# EAGLE design Adafruit Proto Under Plate PiCowBell (EAGLE 9.6.2)
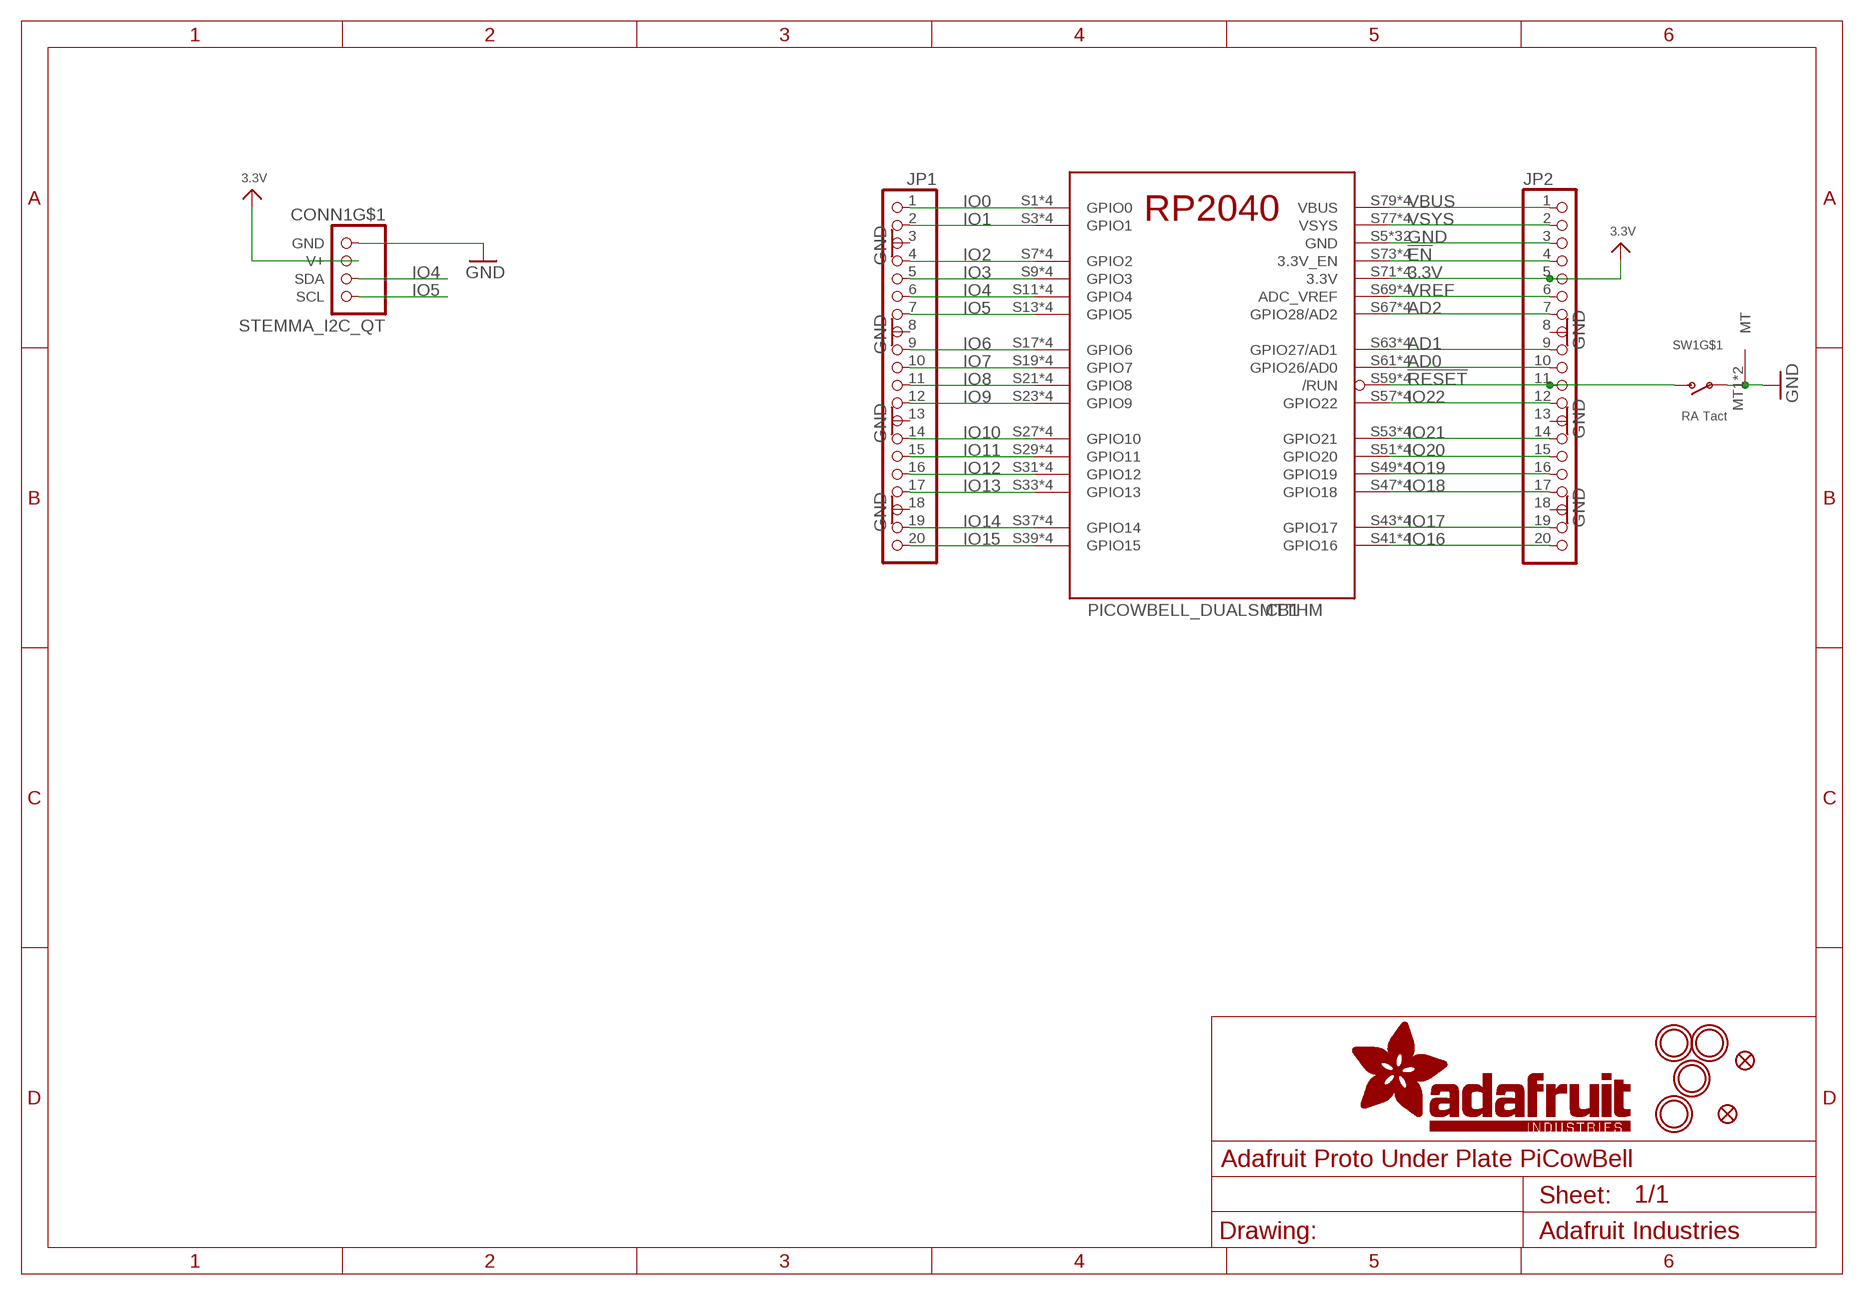
[diagram p0: schematic, sheet 1]

## Parts
CB1  PICOWBELL_DUALSMTTHM  [PICOWBELL_DUALSMTTHM]
CONN1  STEMMA_I2C_QT  [JST_SH4]
FID1  FIDUCIAL_1MM  [FIDUCIAL_1MM]
FID2  FIDUCIAL_1MM  [FIDUCIAL_1MM]
JP1  HEADER-1X20_70MIL  [1X20_ROUND_70MIL]
JP2  HEADER-1X20_70MIL  [1X20_ROUND_70MIL]
SW1  RA Tact  SWITCH_SPST_MNT_TACT_RA  [SPST_TACTILE_RA]
U$5  MOUNTINGHOLE2.5  [MOUNTINGHOLE_2.5_PLATED]
U$7  MOUNTINGHOLE2.5  [MOUNTINGHOLE_2.5_PLATED]
U$8  MOUNTINGHOLE2.5  [MOUNTINGHOLE_2.5_PLATED]
U$9  MOUNTINGHOLE2.5  [MOUNTINGHOLE_2.5_PLATED]

## Nets
3.3V: CB1.S71(3.3V) CB1.S72(3.3V) CB1.T71(3.3V) CB1.T72(3.3V) CONN1.2(V+) JP2.5
!EN: CB1.S73(3.3V_EN) CB1.S74(3.3V_EN) CB1.T73(3.3V_EN) CB1.T74(3.3V_EN) JP2.4
!RESET: CB1.S59(/RUN) CB1.S60(/RUN) CB1.T59(/RUN) CB1.T60(/RUN) JP2.11 SW1.2(S)
AD0: CB1.S61(GPIO26/AD0) CB1.S62(GPIO26/AD0) CB1.T61(GPIO26/AD0) CB1.T62(GPIO26/AD0) JP2.10
AD1: CB1.S63(GPIO27/AD1) CB1.S64(GPIO27/AD1) CB1.T63(GPIO27/AD1) CB1.T64(GPIO27/AD1) JP2.9
AD2: CB1.S67(GPIO28/AD2) CB1.S68(GPIO28/AD2) CB1.T67(GPIO28/AD2) CB1.T68(GPIO28/AD2) JP2.7
GND: CB1.S5(GND) CB1.S6(GND) CB1.S15(GND) CB1.S16(GND) CB1.S25(GND) CB1.S26(GND) CB1.S35(GND) CB1.S36(GND) CB1.S45(GND) CB1.S46(GND) CB1.S55(GND) CB1.S56(GND) CB1.S65(GND) CB1.S66(GND) CB1.S75(GND) CB1.S76(GND) CB1.T5(GND) CB1.T6(GND) CB1.T15(GND) CB1.T16(GND) CB1.T25(GND) CB1.T26(GND) CB1.T35(GND) CB1.T36(GND) CB1.T45(GND) CB1.T46(GND) CB1.T55(GND) CB1.T56(GND) CB1.T65(GND) CB1.T66(GND) CB1.T75(GND) CB1.T76(GND) CONN1.1(GND) JP1.3 JP1.8 JP1.13 JP1.18 JP2.3 JP2.8 JP2.13 JP2.18 SW1.1(P) SW1.MT1(MT) SW1.MT2(MT)
IO0: CB1.S1(GPIO0) CB1.S2(GPIO0) CB1.T1(GPIO0) CB1.T2(GPIO0) JP1.1
IO1: CB1.S3(GPIO1) CB1.S4(GPIO1) CB1.T3(GPIO1) CB1.T4(GPIO1) JP1.2
IO2: CB1.S7(GPIO2) CB1.S8(GPIO2) CB1.T7(GPIO2) CB1.T8(GPIO2) JP1.4
IO3: CB1.S9(GPIO3) CB1.S10(GPIO3) CB1.T9(GPIO3) CB1.T10(GPIO3) JP1.5
IO4: CB1.S11(GPIO4) CB1.S12(GPIO4) CB1.T11(GPIO4) CB1.T12(GPIO4) CONN1.3(SDA) JP1.6
IO5: CB1.S13(GPIO5) CB1.S14(GPIO5) CB1.T13(GPIO5) CB1.T14(GPIO5) CONN1.4(SCL) JP1.7
IO6: CB1.S17(GPIO6) CB1.S18(GPIO6) CB1.T17(GPIO6) CB1.T18(GPIO6) JP1.9
IO7: CB1.S19(GPIO7) CB1.S20(GPIO7) CB1.T19(GPIO7) CB1.T20(GPIO7) JP1.10
IO8: CB1.S21(GPIO8) CB1.S22(GPIO8) CB1.T21(GPIO8) CB1.T22(GPIO8) JP1.11
IO9: CB1.S23(GPIO9) CB1.S24(GPIO9) CB1.T23(GPIO9) CB1.T24(GPIO9) JP1.12
IO10: CB1.S27(GPIO10) CB1.S28(GPIO10) CB1.T27(GPIO10) CB1.T28(GPIO10) JP1.14
IO11: CB1.S29(GPIO11) CB1.S30(GPIO11) CB1.T29(GPIO11) CB1.T30(GPIO11) JP1.15
IO12: CB1.S31(GPIO12) CB1.S32(GPIO12) CB1.T31(GPIO12) CB1.T32(GPIO12) JP1.16
IO13: CB1.S33(GPIO13) CB1.S34(GPIO13) CB1.T33(GPIO13) CB1.T34(GPIO13) JP1.17
IO14: CB1.S37(GPIO14) CB1.S38(GPIO14) CB1.T37(GPIO14) CB1.T38(GPIO14) JP1.19
IO15: CB1.S39(GPIO15) CB1.S40(GPIO15) CB1.T39(GPIO15) CB1.T40(GPIO15) JP1.20
IO16: CB1.S41(GPIO16) CB1.S42(GPIO16) CB1.T41(GPIO16) CB1.T42(GPIO16) JP2.20
IO17: CB1.S43(GPIO17) CB1.S44(GPIO17) CB1.T43(GPIO17) CB1.T44(GPIO17) JP2.19
IO18: CB1.S47(GPIO18) CB1.S48(GPIO18) CB1.T47(GPIO18) CB1.T48(GPIO18) JP2.17
IO19: CB1.S49(GPIO19) CB1.S50(GPIO19) CB1.T49(GPIO19) CB1.T50(GPIO19) JP2.16
IO20: CB1.S51(GPIO20) CB1.S52(GPIO20) CB1.T51(GPIO20) CB1.T52(GPIO20) JP2.15
IO21: CB1.S53(GPIO21) CB1.S54(GPIO21) CB1.T53(GPIO21) CB1.T54(GPIO21) JP2.14
IO22: CB1.S57(GPIO22) CB1.S58(GPIO22) CB1.T57(GPIO22) CB1.T58(GPIO22) JP2.12
VBUS: CB1.S79(VBUS) CB1.S80(VBUS) CB1.T79(VBUS) CB1.T80(VBUS) JP2.1
VREF: CB1.S69(ADC_VREF) CB1.S70(ADC_VREF) CB1.T69(ADC_VREF) CB1.T70(ADC_VREF) JP2.6
VSYS: CB1.S77(VSYS) CB1.S78(VSYS) CB1.T77(VSYS) CB1.T78(VSYS) JP2.2
Unconnected: CONN1.MT1(MT) CONN1.MT2(MT)

## Library data of the parts
CB1 = adafruit_micro:PICOWBELL
CONN1 = adafruit_electromech:STEMMA_I2C; LCSC: C2845363
FID1 FID2 = microbuilder:FIDUCIAL: Fiducial Alignment Points Various fiducial points for machine vision alignment.; BOM: EXCLUDE
JP1 JP2 = adafruit_electromech:HEADER-1X20
SW1 = adafruit_electromech:SWITCH_SPST_MNT: Switch - SPST 4UCon 19192 (6.7x2.6mm SMT); LCSC: C778159
U$5 U$7-U$9 = adafruit_electromech:MOUNTINGHOLE: Mounting Hole For #2 screws (0.086"/2.18mm width, 0.094"/2.4mm hole) use 2.5mm; BOM: EXCLUDE

## Board
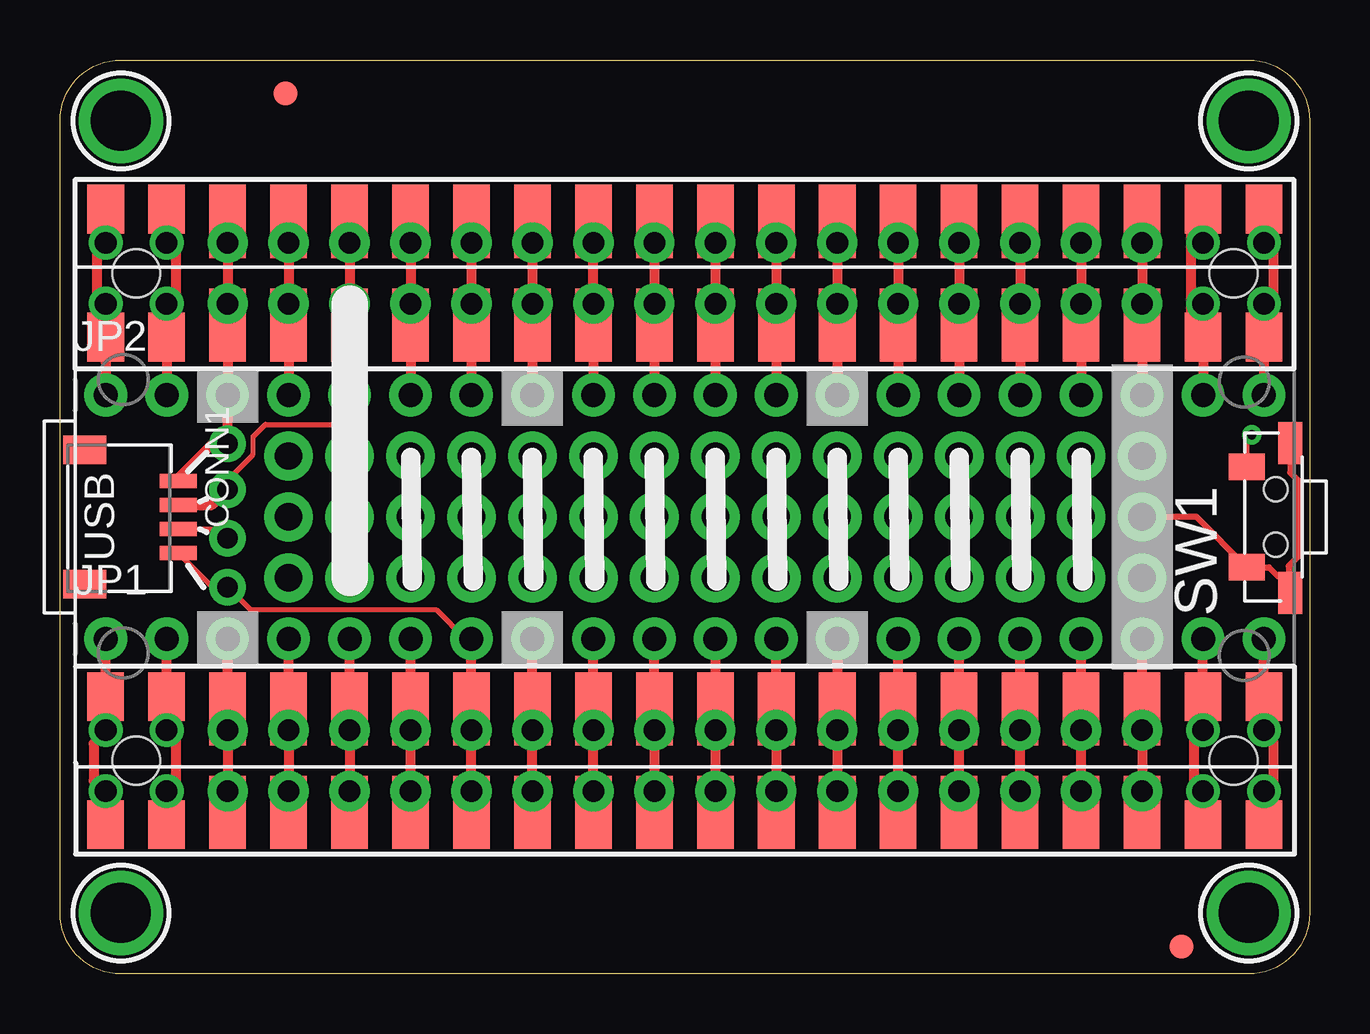
[diagram p1: board, top side]
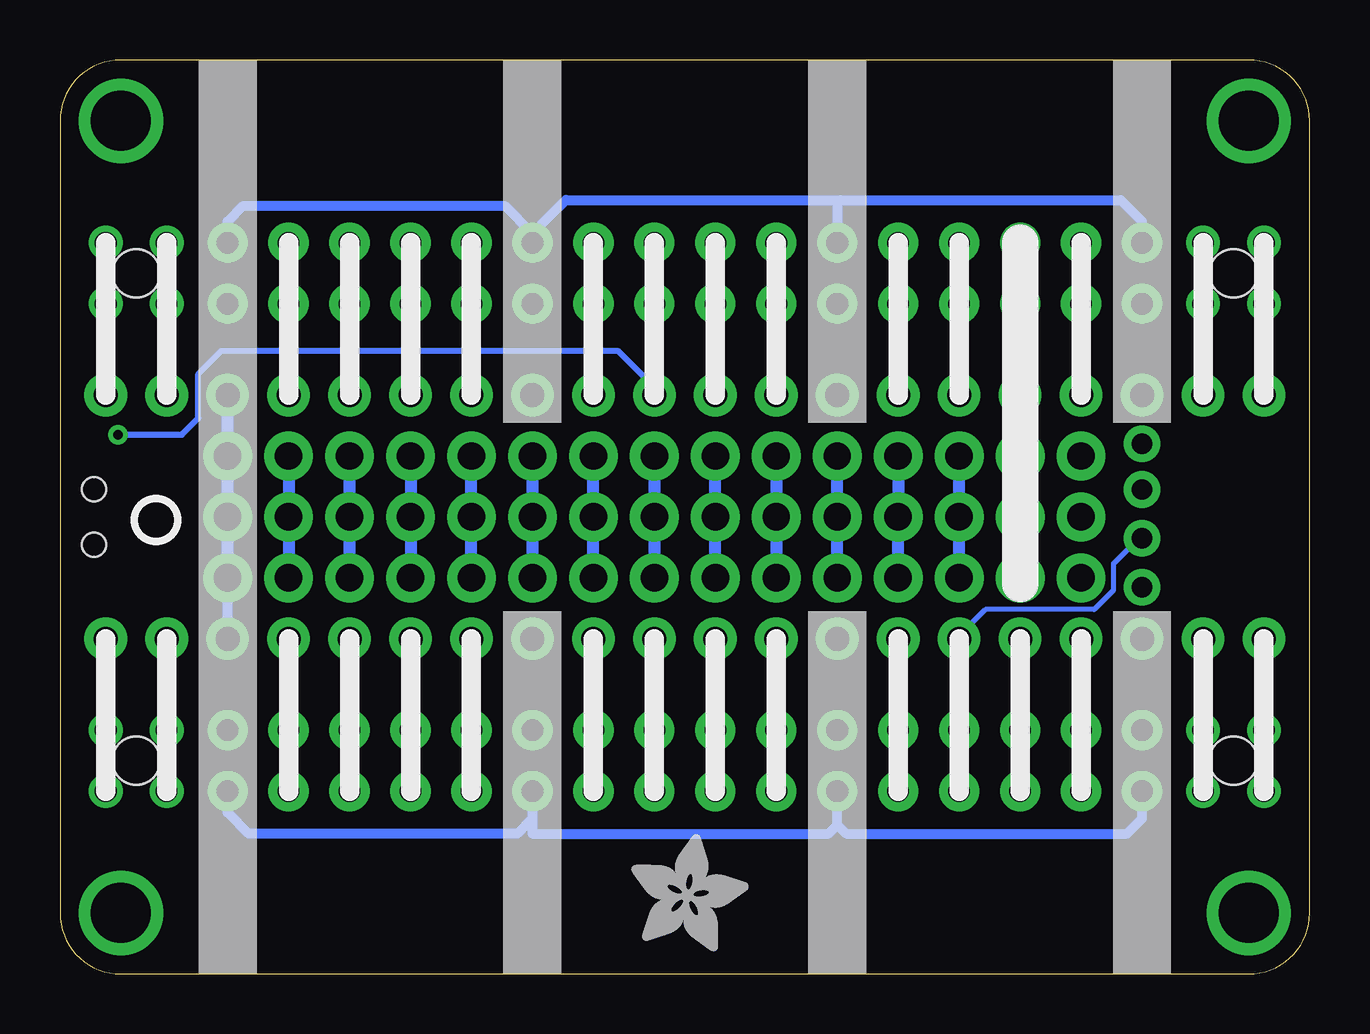
[diagram p2: board, bottom side, seen from below]

Size 52.07 x 38.1 mm. Coordinates in mm from the lower left corner, seen from the top.
Outline: 49.53,0 2.54,0 arc-90 0,2.54 0,35.56 arc-90 2.54,38.1 49.53,38.1 arc-90 52.07,35.56 52.07,2.54 arc-90 49.53,0
Copper layers (1*16): Top 0.035mm / dielectric 1.5mm / Bottom 0.035mm
Design rules "adafruit": minimum track width 8mil, minimum drill 15.5mil, track to track 8mil, track to pad 8mil, pad to pad 8mil, via to via 8mil, smd to smd 8mil, copper to edge 10mil, drill to drill 8mil, minimum pad ring 10mil, minimum via ring 8mil, stop-mask expansion 2mil, vias tented up to drill 20mil, thermal gap 10mil

### Footprints (pad centres in the part's own frame; a part is rotated, then mirrored left to right if it is on the bottom)
PICOWBELL_DUALSMTTHM = smd 1.524 x 2.032: S1 -24.13,-12.829; S2 -24.13,-7.495; S3 -21.59,-12.829; S4 -21.59,-7.495; S37 21.59,-12.829; S38 21.59,-7.495; S39 24.13,-12.829; S40 24.13,-7.495; S41 24.13,12.829; S42 24.13,7.495; S43 21.59,12.829; S44 21.59,7.495; S77 -21.59,7.495; S78 -21.59,12.829; S79 -24.13,7.495; S80 -24.13,12.829 | smd 1.524 x 3.048: S5 -19.05,-12.321; S6 -19.05,-8.003; S7 -16.51,-12.321; S8 -16.51,-8.003; S9 -13.97,-12.321; S10 -13.97,-8.003; S11 -11.43,-12.321; S12 -11.43,-8.003; S13 -8.89,-12.321; S14 -8.89,-8.003; S15 -6.35,-12.321; S16 -6.35,-8.003; S17 -3.81,-12.321; S18 -3.81,-8.003; S19 -1.27,-12.321; S20 -1.27,-8.003; S21 1.27,-12.321; S22 1.27,-8.003; S23 3.81,-12.321; S24 3.81,-8.003; S25 6.35,-12.321; S26 6.35,-8.003; S27 8.89,-12.321; S28 8.89,-8.003; S29 11.43,-12.321; S30 11.43,-8.003; S31 13.97,-12.321; S32 13.97,-8.003; S33 16.51,-12.321; S34 16.51,-8.003; S35 19.05,-12.321; S36 19.05,-8.003; S45 19.05,8.003; S46 19.05,12.321; S47 16.51,8.003; S48 16.51,12.321; S49 13.97,8.003; S50 13.97,12.321; S51 11.43,8.003; S52 11.43,12.321; S53 8.89,8.003; S54 8.89,12.321; S55 6.35,8.003; S56 6.35,12.321; S57 3.81,8.003; S58 3.81,12.321; S59 1.27,8.003; S60 1.27,12.321; S61 -1.27,8.003; S62 -1.27,12.321; S63 -3.81,8.003; S64 -3.81,12.321; S65 -6.35,8.003; S66 -6.35,12.321; S67 -8.89,8.003; S68 -8.89,12.321; S69 -11.43,8.003; S70 -11.43,12.321; S71 -13.97,8.003; S72 -13.97,12.321; S73 -16.51,8.003; S74 -16.51,12.321; S75 -19.05,8.003; S76 -19.05,12.321 | drill 0.9 pad 1.27: T1 -24.13,-11.43; T2 -24.13,-8.89; T3 -21.59,-11.43; T4 -21.59,-8.89; T37 21.59,-11.43; T38 21.59,-8.89; T39 24.13,-11.43; T40 24.13,-8.89; T41 24.13,11.43; T42 24.13,8.89; T43 21.59,11.43; T44 21.59,8.89; T77 -21.59,11.43; T78 -21.59,8.89; T79 -24.13,11.43; T80 -24.13,8.89 | drill 0.9 pad 1.676: T5 -19.05,-11.43; T6 -19.05,-8.89; T7 -16.51,-11.43; T8 -16.51,-8.89; T9 -13.97,-11.43; T10 -13.97,-8.89; T11 -11.43,-11.43; T12 -11.43,-8.89; T13 -8.89,-11.43; T14 -8.89,-8.89; T15 -6.35,-11.43; T16 -6.35,-8.89; T17 -3.81,-11.43; T18 -3.81,-8.89; T19 -1.27,-11.43; T20 -1.27,-8.89; T21 1.27,-11.43; T22 1.27,-8.89; T23 3.81,-11.43; T24 3.81,-8.89; T25 6.35,-11.43; T26 6.35,-8.89; T27 8.89,-11.43; T28 8.89,-8.89; T29 11.43,-11.43; T30 11.43,-8.89; T31 13.97,-11.43; T32 13.97,-8.89; T33 16.51,-11.43; T34 16.51,-8.89; T35 19.05,-11.43; T36 19.05,-8.89; T45 19.05,11.43; T46 19.05,8.89; T47 16.51,11.43; T48 16.51,8.89; T49 13.97,11.43; T50 13.97,8.89; T51 11.43,11.43; T52 11.43,8.89; T53 8.89,11.43; T54 8.89,8.89; T55 6.35,11.43; T56 6.35,8.89; T57 3.81,11.43; T58 3.81,8.89; T59 1.27,11.43; T60 1.27,8.89; T61 -1.27,11.43; T62 -1.27,8.89; T63 -3.81,11.43; T64 -3.81,8.89; T65 -6.35,11.43; T66 -6.35,8.89; T67 -8.89,11.43; T68 -8.89,8.89; T69 -11.43,11.43; T70 -11.43,8.89; T71 -13.97,11.43; T72 -13.97,8.89; T73 -16.51,11.43; T74 -16.51,8.89; T75 -19.05,11.43; T76 -19.05,8.89 | hole 2: -22.86,-10.16; 22.86,-10.16; 22.86,10.16; -22.86,10.16
JST_SH4 = smd 0.6 x 1.55: 1 -1.5,2.006; 2 -0.5,2.006; 3 0.5,2.006; 4 1.5,2.006 | smd 1.2 x 1.8: MT1 -2.8,-1.894; MT2 2.8,-1.894
FIDUCIAL_1MM = smd 1 x 1: 1 0,0
1X20_ROUND_70MIL = drill 1 pad 1.778: 1 -24.13,0; 2 -21.59,0; 3 -19.05,0; 4 -16.51,0; 5 -13.97,0; 6 -11.43,0; 7 -8.89,0; 8 -6.35,0; 9 -3.81,0; 10 -1.27,0; 11 1.27,0; 12 3.81,0; 13 6.35,0; 14 8.89,0; 15 11.43,0; 16 13.97,0; 17 16.51,0; 18 19.05,0; 19 21.59,0; 20 24.13,0
SPST_TACTILE_RA = smd 1.1 x 1.5: 1 2.1,-0.9; 2 -2.1,-0.9 | smd 1.75 x 1: MT1 3.175,0.9; MT2 -3.075,0.9 | hole 1: 1.15,0.3; -1.15,0.3
MOUNTINGHOLE_2.5_PLATED = drill 2.5 pad 3.2: P$1 0,0

### Placement (x,y rotation side)
CB1  26.04,19.05 0 top
CONN1  2.92,19.05 270 top
FID1  9.4,36.7 0 top
FID2  46.74,1.14 0 top
JP1  26.04,13.97 0 top
JP2  26.04,24.13 0 top
PLABEL0  [PLABEL0]  47.88,19.05 270 top
PLABEL1  [PLABEL1]  6.86,4.7 90 top
PLABEL2  [PLABEL2]  9.4,4.7 90 top
PLABEL3  [PLABEL3]  11.94,4.7 90 top
PLABEL4  [PLABEL4]  14.48,4.7 90 top
PLABEL5  [PLABEL5]  17.02,4.7 90 top
PLABEL6  [PLABEL6]  19.56,4.7 90 top
PLABEL7  [PLABEL7]  32.26,4.7 90 top
PLABEL8  [PLABEL8]  44.96,4.7 90 top
PLABEL9  [PLABEL9]  22.1,4.7 90 top
PLABEL10  [PLABEL10]  24.64,4.7 90 top
PLABEL11  [PLABEL11]  27.18,4.7 90 top
PLABEL12  [PLABEL12]  29.72,4.7 90 top
PLABEL13  [PLABEL13]  34.8,4.7 90 top
PLABEL14  [PLABEL14]  39.88,4.7 90 top
PLABEL15  [PLABEL15]  37.34,4.7 90 top
PLABEL16  [PLABEL16]  42.42,4.7 90 top
PLABEL17  [PLABEL17]  45.09,33.4 90 top
PLABEL18  [PLABEL18]  32.38,33.4 90 top
PLABEL19  [PLABEL19]  19.69,33.4 90 top
PLABEL20  [PLABEL20]  6.98,33.4 90 top
PLABEL21  [PLABEL21]  9.52,33.4 90 top
PLABEL22  [PLABEL22]  12.06,33.4 90 top
PLABEL23  [PLABEL23]  14.61,33.4 90 top
PLABEL24  [PLABEL24]  17.14,33.4 90 top
PLABEL25  [PLABEL25]  22.23,33.4 90 top
PLABEL26  [PLABEL26]  24.77,33.4 90 top
PLABEL27  [PLABEL27]  27.3,33.4 90 top
PLABEL28  [PLABEL28]  29.84,33.4 90 top
PLABEL29  [PLABEL29]  34.92,33.4 90 top
PLABEL30  [PLABEL30]  37.47,33.4 90 top
PLABEL31  [PLABEL31]  40.01,33.4 90 top
PLABEL32  [PLABEL32]  42.55,33.4 90 top
PLABEL33  [PLABEL33]  38.99,34.54 0 bottom
PLABEL34  [PLABEL34]  26.16,34.67 0 bottom
PLABEL35  [PLABEL35]  13.08,34.73 0 bottom
PLABEL36  [PLABEL36]  38.86,3.49 0 bottom
PLABEL37  [PLABEL37]  13.34,3.37 0 bottom
PLABEL38  [PLABEL38]  5.97,22.1 0 bottom
PLABEL39  [PLABEL39]  5.97,20.19 0 bottom
PLABEL40  [PLABEL40]  5.97,18.16 0 bottom
PLABEL41  [PLABEL41]  5.97,16.13 0 bottom
PLABEL42  [PLABEL42]  1.4,19.05 270 bottom
SW1  50.36,19.05 270 top
U$5  2.54,2.54 0 top
U$6  [PCBFEAT-REV-040]  48.07,18.92 180 bottom
U$7  49.53,2.54 0 top
U$8  2.54,35.56 0 top
U$9  49.53,35.56 0 top
U$10  [ADAFRUIT_5MM]  28.26,0.95 0 bottom

### Tracks (layer width: path | path; a pad name or v marks a point on that pad's centre or on a via)
3.3V  (via drill 0.85 pad 1.52, 1.14 pad 2.03)
  Top 0.203: v6.98,20.19 6.98,20.59 8.05,21.66 8.05,22.4 8.56,22.91 12.01,22.91 12.06,22.86
  Top 0.406: CONN1.2 6.34,19.55 v6.98,20.19 | CB1.S71 JP2.5 | JP2.5 | CB1.T71 12.06,30.54 CB1.S72 12.06,28 CB1.T72
  Top 0.813: v12.06,16.51 v12.06,19.05 v12.06,21.59 12.06,22.86 JP2.5 | JP2.5
!EN
  Top 0.406: JP2.4 CB1.S73 9.52,27.11 CB1.T74 9.52,28 CB1.S74 9.52,30.54 CB1.T73 | JP2.4
!RESET  (via drill 0.39)
  Top 0.254: SW1.2 49.46,22.28 v49.66,22.48
  Top 0.406: JP2.11 CB1.S59 27.3,28 | JP2.11 | CB1.T59 27.3,31.43 CB1.S60 27.3,28 | 27.3,28 CB1.T60
  Bottom 0.254: v49.66,22.48 46.99,22.48 46.3,23.16 46.3,25.02 45.34,25.98 28.83,25.98 27.3,24.46 JP2.11
AD0
  Top 0.406: CB1.S61 JP2.10 | JP2.10 | CB1.T61 24.77,31.43 CB1.S62 24.77,28 CB1.T62
  Top 0.508: CB1.S61 24.77,27.11 CB1.T62
AD1
  Top 0.406: CB1.S63 JP2.9 | JP2.9 | CB1.S64 22.23,31.43 CB1.T63 22.23,30.54 CB1.S63 | CB1.S63 22.23,27.11 CB1.T64
AD2
  Top 0.406: CB1.S67 JP2.7 | JP2.7 | CB1.T67 17.14,30.54 CB1.S68 17.14,28 CB1.T68
GND  (via drill 0.85 pad 1.52, 1.14 pad 2.03)
  Top 0.203: 6.98,22.73 v6.98,22.1
  Top 0.254: SW1.MT2 51.26,20.91 51.6,20.57 51.6,17.41 51.19,17 51.19,16.13 | SW1.MT1 51.26,16.07 51.19,16.13 | 51.19,16.13 50.37,16.95 SW1.1 47.36,19.05 v45.09,19.05
  Top 0.406: v6.98,22.1 JP2.3 | CONN1.1 4.93,20.68 6.98,22.73 | CB1.S6 6.98,10.99 CB1.T6 | CB1.S6 6.98,7.56 | 6.98,7.56 CB1.T5 | CB1.S5 6.98,7.56 | CB1.T16 19.69,10.99 CB1.S16 JP1.8 | CB1.T15 19.69,6.67 CB1.S15 CB1.T16 | CB1.T16 | 32.38,7.56 CB1.T25 | CB1.S25 32.38,7.56 | CB1.S35 45.09,6.67 CB1.T35 CB1.T36 45.09,10.99 CB1.S36 JP1.18 | JP1.18 | JP1.8 | CB1.S6 6.98,13.89 | CB1.S45 JP2.18 | JP2.18 | CB1.S55 JP2.13 | JP2.13 | CB1.S65 JP2.8 | JP2.8 | CB1.S75 JP2.3 | JP2.3 | CB1.T75 6.98,30.54 CB1.S76 6.98,28 CB1.T76 | CB1.T66 19.69,28 CB1.S66 19.69,30.54 CB1.T65 | CB1.T45 45.09,30.54 CB1.S46 45.09,28 CB1.T46 | CB1.T55 32.38,30.54 CB1.S56 32.38,28 CB1.T56 | CB1.S26 32.38,10.99 CB1.T26 | CB1.S26 32.38,7.56 | CB1.S26 32.38,10.99 JP1.13
  Top 0.508: CB1.S45 45.09,27.11 CB1.T46 | CB1.S65 19.69,27.11 CB1.T66 | CB1.S75 6.98,27.11 CB1.T76 | CB1.S55 32.38,27.11 CB1.T56 | JP1.3 6.98,13.89 | 6.98,13.89
  Bottom 0.406: CB1.T75 CB1.S76 7.87,32.26 19.56,32.26 | 32.38,30.86 30.99,32.26 19.56,32.26 | CB1.T55 32.38,30.86 | 32.38,30.86 33.53,32 44.45,32 CB1.S46 CB1.T45 | CB1.T35 CB1.S35 44.2,5.84 33.02,5.84 32.38,6.48 CB1.T25 32.38,5.84 20.07,5.84 19.69,6.22 | 19.69,6.22 CB1.T15 | 19.69,6.22 19.3,5.84 7.62,5.84 6.98,6.48 CB1.T5 | JP1.18 v45.09,16.51 | 19.56,32.26 19.69,32.13 CB1.T65
  Bottom 0.508: v45.09,16.51 v45.09,19.05 v45.09,21.59 JP2.18
IO0
  Top 0.406: CB1.S1 1.91,7.56 CB1.T1 1.4,8.07 1.4,9.59 CB1.T2 1.91,10.99 CB1.S2 JP1.1 | JP1.1
IO1
  Top 0.406: CB1.S4 4.45,10.99 CB1.T4 | CB1.S3 4.45,7.56 CB1.T3 4.83,7.94 4.83,11.11 CB1.S4 | CB1.S4 JP1.2 | JP1.2
IO2
  Top 0.406: CB1.S7 9.52,7.56 | 9.52,7.56 CB1.T7 9.52,7.56 | CB1.S8 9.52,10.99 CB1.T8 | CB1.S8 9.52,7.56 | CB1.S8 JP1.4 | JP1.4
IO3
  Top 0.406: CB1.S9 12.06,7.56 CB1.T9 CB1.T10 12.06,10.99 CB1.S10 JP1.5 | JP1.5
IO4  (via drill 0.85 pad 1.52)
  Top 0.203: CONN1.3 6.47,18.55 6.86,18.16 v6.98,18.16
  Top 0.406: CB1.T11 14.61,7.56 CB1.S11 14.61,10.1 CB1.T12 14.61,10.99 CB1.S12 JP1.6 | JP1.6
  Bottom 0.203: v6.98,18.16 7.11,18.16 8.18,17.09 8.18,15.99 8.98,15.19 13.51,15.19 14.61,14.1 JP1.6
IO5  (via drill 0.85 pad 1.52)
  Top 0.203: CONN1.4 6.35,16.13 v6.98,16.13 7.93,15.19 15.67,15.19 16.89,13.97 JP1.7
  Top 0.406: CB1.S13 17.14,6.67 CB1.T13 CB1.T14 17.14,10.99 CB1.S14 JP1.7 | JP1.7
IO6
  Top 0.406: CB1.S17 22.23,6.67 CB1.T17 CB1.T18 22.23,10.99 CB1.S18 JP1.9 | JP1.9
IO7
  Top 0.406: CB1.S19 24.77,6.67 CB1.T19 CB1.T20 24.77,10.99 | CB1.S20 24.77,10.99 | 24.77,10.99 JP1.10
IO8
  Top 0.406: 27.3,10.99 CB1.T22 | CB1.S21 27.3,6.67 CB1.T21 27.3,7.56 CB1.S22 27.3,10.99 | JP1.11 27.3,10.99
IO9
  Top 0.406: CB1.S23 29.84,6.67 CB1.T23 29.84,7.56 CB1.S24 | CB1.S24 29.84,10.99 CB1.T24 | CB1.S24 JP1.12 | JP1.12
IO10
  Top 0.406: CB1.T27 34.92,6.67 CB1.S27 34.92,10.1 CB1.T28 34.92,10.99 CB1.S28 JP1.14 | JP1.14
IO11
  Top 0.406: CB1.T29 37.47,6.67 CB1.S29 37.47,10.1 CB1.T30 37.47,10.99 CB1.S30 JP1.15 | JP1.15
IO12
  Top 0.406: CB1.S31 40.01,6.67 CB1.T31 CB1.T32 40.01,10.99 CB1.S32 JP1.16 | JP1.16
IO13
  Top 0.406: CB1.T33 42.55,6.67 CB1.S33 42.55,10.1 CB1.T34 42.55,10.99 CB1.S34 JP1.17 | JP1.17
IO14
  Top 0.406: CB1.S37 47.62,6.67 CB1.T37 47.24,7.94 47.24,9.72 CB1.T38 47.62,10.99 CB1.S38 JP1.19 | JP1.19
IO15
  Top 0.406: CB1.T39 50.16,7.56 CB1.S39 50.55,6.54 50.55,9.72 CB1.T40 50.16,10.1 CB1.S40 JP1.20 | JP1.20
IO16
  Top 0.406: JP2.20 CB1.S42 50.16,28 | JP2.20 | CB1.T41 50.16,30.54 CB1.S41 50.55,31.56 50.55,28 50.16,28 | 50.16,28 CB1.T42
IO17
  Top 0.406: JP2.19 CB1.S44 47.12,27.11 47.12,31.43 CB1.S43 47.62,31.43 CB1.T43 | JP2.19 | 47.62,28 CB1.T44
  Top 0.508: CB1.S44 47.62,28
IO18
  Top 0.406: CB1.S47 JP2.17 | JP2.17 | CB1.T47 42.55,30.54 CB1.S48 42.55,28 CB1.T48
  Top 0.508: CB1.S47 42.55,28
IO19
  Top 0.406: CB1.S49 JP2.16 | JP2.16 | CB1.T49 40.01,31.43 CB1.S50 40.01,28 CB1.T50
  Top 0.508: CB1.S49 40.01,27.11 CB1.T50
IO20
  Top 0.406: CB1.S51 JP2.15 | JP2.15 | CB1.T51 37.47,30.54 CB1.S52 37.47,28 CB1.T52
IO21
  Top 0.406: CB1.S53 JP2.14 | JP2.14 | CB1.T53 34.92,30.54 CB1.S54 34.92,28 CB1.T54
  Top 0.508: CB1.S53 34.92,27.11 CB1.T54
IO22
  Top 0.406: CB1.S57 JP2.12 | JP2.12 | CB1.T57 29.84,31.43 CB1.S58 29.84,28 CB1.T58
N$49  (via drill 1.14 pad 2.03)
  other vias: 9.52,16.51
N$50  (via drill 1.14 pad 2.03)
  other vias: 9.52,19.05
N$51  (via drill 1.14 pad 2.03)
  other vias: 9.52,21.59
PR1  (via drill 1.14 pad 2.03)
  Bottom 0.508: v14.61,16.51 v14.61,19.05 v14.61,21.59
PR2  (via drill 1.14 pad 2.03)
  Bottom 0.508: v17.14,21.59 v17.14,19.05 v17.14,16.51
PR3  (via drill 1.14 pad 2.03)
  Bottom 0.508: v19.69,16.51 v19.69,19.05 v19.69,21.59
PR4  (via drill 1.14 pad 2.03)
  Bottom 0.508: v22.23,21.59 v22.23,19.05 v22.23,16.51
PR5  (via drill 1.14 pad 2.03)
  Bottom 0.508: v24.77,16.51 v24.77,19.05 v24.77,21.59
PR6  (via drill 1.14 pad 2.03)
  Bottom 0.508: v27.3,21.59 v27.3,19.05 v27.3,16.51
PR7  (via drill 1.14 pad 2.03)
  Bottom 0.508: v29.84,16.51 v29.84,19.05 v29.84,21.59
PR8  (via drill 1.14 pad 2.03)
  Bottom 0.508: v32.38,21.59 v32.38,19.05 v32.38,16.51
PR9  (via drill 1.14 pad 2.03)
  Bottom 0.508: v34.92,16.51 v34.92,19.05 v34.92,21.59
PR10  (via drill 1.14 pad 2.03)
  Bottom 0.508: v37.47,21.59 v37.47,19.05 v37.47,16.51
PR11  (via drill 1.14 pad 2.03)
  Bottom 0.508: v40.01,16.51 v40.01,19.05 v40.01,21.59
PR12  (via drill 1.14 pad 2.03)
  Bottom 0.508: v42.55,21.59 v42.55,19.05 v42.55,16.51
VBUS
  Top 0.406: CB1.S79 1.91,25.53 | 1.91,25.53 | 1.91,25.53 JP2.1 | CB1.S79 1.91,28 CB1.T80 | CB1.S79 1.52,26.99 1.52,30.16 CB1.T79 1.91,30.54 CB1.S80
VREF
  Top 0.406: JP2.6 CB1.S69 14.61,28 | JP2.6 | CB1.T69 14.61,30.54 CB1.S70 14.61,28 | 14.61,28 CB1.T70
VSYS
  Top 0.406: CB1.S77 JP2.2 | JP2.2 | CB1.S77 4.45,27.11 CB1.T78 | CB1.S77 4.83,26.99 4.83,30.54 4.45,30.54 | 4.45,30.54 CB1.T77 | CB1.S78 4.45,30.54

### Text on the board
Pinguin_tBackup: GND | EN | 3.3V | VREF | AD2 | GND | AD1 | AD0 | RST | IO22 | GND | IO21 | IO20 | IO19 | IO18 | GND | VB | VS | 3V | Vr | A0 | R | 22 | 20 | 19 | 18 | 17 | 16 | A2 | I2C | G | 3 | RESET | D | C | QT | 0 | 1 | 2 | 3 | 4 | 5 | 6 | 7 | 8 | 9 | 11 | 12 | 13 | 14 | 15 | GND | IO2 | IO3 | IO4 | IO5 | GND | IO6 | IO7 | IO8 | IO9 | GND | IO10 | IO11 | IO12 | IO13 | GND
Pinguin_bBackup: Under | Proto | Plate | VB | VS | 3V | Vr | A2 | A0 | R | 22 | 20 | 19 | 18 | 17 | 16 | GN | GND | 3V | 3.3V | USB | Prototyping / PiCowbell | DA | SDA | SCL | CL | 0 | 1 | 2 | 3 | 4 | 5 | 6 | 7 | 8 | 9 | 11 | 12 | 13 | 14 | 15 | Bell | PiCow